# EAGLE schematic SevenSegClock (EAGLE 7.0.0)
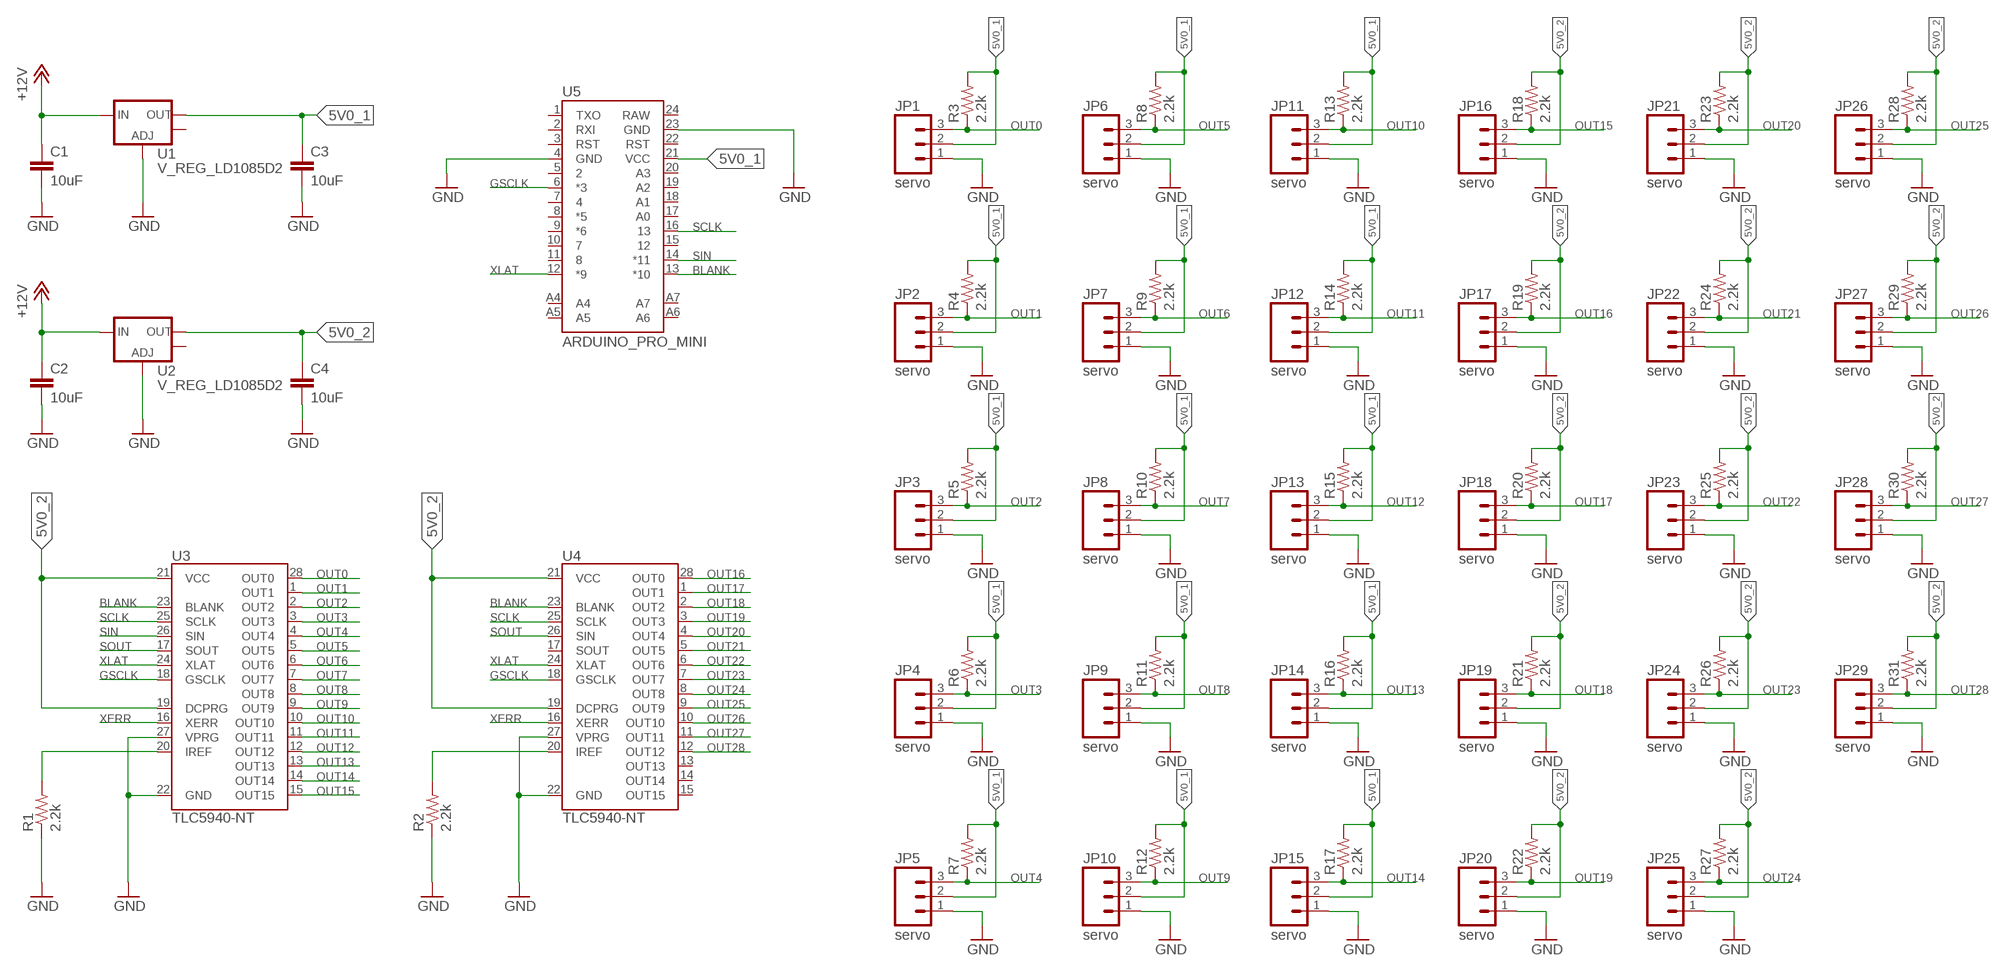
[diagram p0: schematic, sheet 1]

## Parts
C1  10uF  CAPPTH1  [CAP-PTH-5MM]
C2  10uF  CAPPTH1  [CAP-PTH-5MM]
C3  10uF  CAPPTH1  [CAP-PTH-5MM]
C4  10uF  CAPPTH1  [CAP-PTH-5MM]
JP1  servo  M03PTH  [1X03]
JP2  servo  M03PTH  [1X03]
JP3  servo  M03PTH  [1X03]
JP4  servo  M03PTH  [1X03]
JP5  servo  M03PTH  [1X03]
JP6  servo  M03PTH  [1X03]
JP7  servo  M03PTH  [1X03]
JP8  servo  M03PTH  [1X03]
JP9  servo  M03PTH  [1X03]
JP10  servo  M03PTH  [1X03]
JP11  servo  M03PTH  [1X03]
JP12  servo  M03PTH  [1X03]
JP13  servo  M03PTH  [1X03]
JP14  servo  M03PTH  [1X03]
JP15  servo  M03PTH  [1X03]
JP16  servo  M03PTH  [1X03]
JP17  servo  M03PTH  [1X03]
JP18  servo  M03PTH  [1X03]
JP19  servo  M03PTH  [1X03]
JP20  servo  M03PTH  [1X03]
JP21  servo  M03PTH  [1X03]
JP22  servo  M03PTH  [1X03]
JP23  servo  M03PTH  [1X03]
JP24  servo  M03PTH  [1X03]
JP25  servo  M03PTH  [1X03]
JP26  servo  M03PTH  [1X03]
JP27  servo  M03PTH  [1X03]
JP28  servo  M03PTH  [1X03]
JP29  servo  M03PTH  [1X03]
R1  2.2k  R-US_0204/5  [0204/5]
R2  2.2k  R-US_0204/5  [0204/5]
R3  2.2k  R-US_0204/5  [0204/5]
R4  2.2k  R-US_0204/5  [0204/5]
R5  2.2k  R-US_0204/5  [0204/5]
R6  2.2k  R-US_0204/5  [0204/5]
R7  2.2k  R-US_0204/5  [0204/5]
R8  2.2k  R-US_0204/5  [0204/5]
R9  2.2k  R-US_0204/5  [0204/5]
R10  2.2k  R-US_0204/5  [0204/5]
R11  2.2k  R-US_0204/5  [0204/5]
R12  2.2k  R-US_0204/5  [0204/5]
R13  2.2k  R-US_0204/5  [0204/5]
R14  2.2k  R-US_0204/5  [0204/5]
R15  2.2k  R-US_0204/5  [0204/5]
R16  2.2k  R-US_0204/5  [0204/5]
R17  2.2k  R-US_0204/5  [0204/5]
R18  2.2k  R-US_0204/5  [0204/5]
R19  2.2k  R-US_0204/5  [0204/5]
R20  2.2k  R-US_0204/5  [0204/5]
R21  2.2k  R-US_0204/5  [0204/5]
R22  2.2k  R-US_0204/5  [0204/5]
R23  2.2k  R-US_0204/5  [0204/5]
R24  2.2k  R-US_0204/5  [0204/5]
R25  2.2k  R-US_0204/5  [0204/5]
R26  2.2k  R-US_0204/5  [0204/5]
R27  2.2k  R-US_0204/5  [0204/5]
R28  2.2k  R-US_0204/5  [0204/5]
R29  2.2k  R-US_0204/5  [0204/5]
R30  2.2k  R-US_0204/5  [0204/5]
R31  2.2k  R-US_0204/5  [0204/5]
U1  V_REG_LD1085D2  [D2PACK/A]
U2  V_REG_LD1085D2  [D2PACK/A]
U3  TLC5940-NT  [DIL28-3]
U4  TLC5940-NT  [DIL28-3]
U5  ARDUINO_PRO_MINI  [ARDUINO_PRO_MINI]

## Nets
5V0_1: C3.1 JP1.2 JP2.2 JP3.2 JP4.2 JP5.2 JP6.2 JP7.2 JP8.2 JP9.2 JP10.2 JP11.2 JP12.2 JP13.2 JP14.2 JP15.2 R3.2 R4.2 R5.2 R6.2 R7.2 R8.2 R9.2 R10.2 R11.2 R12.2 R13.2 R14.2 R15.2 R16.2 R17.2 U1.2(OUT) U5.21(VCC)
5V0_2: C4.1 JP16.2 JP17.2 JP18.2 JP19.2 JP20.2 JP21.2 JP22.2 JP23.2 JP24.2 JP25.2 JP26.2 JP27.2 JP28.2 JP29.2 R18.2 R19.2 R20.2 R21.2 R22.2 R23.2 R24.2 R25.2 R26.2 R27.2 R28.2 R29.2 R30.2 R31.2 U2.2(OUT) U3.19(DCPRG) U3.21(VCC) U4.19(DCPRG) U4.21(VCC)
+12V: C1.1 C2.1 U1.3(IN) U2.3(IN)
BLANK: U3.23(BLANK) U4.23(BLANK) U5.13(*10)
GND: C1.2 C2.2 C3.2 C4.2 JP1.1 JP2.1 JP3.1 JP4.1 JP5.1 JP6.1 JP7.1 JP8.1 JP9.1 JP10.1 JP11.1 JP12.1 JP13.1 JP14.1 JP15.1 JP16.1 JP17.1 JP18.1 JP19.1 JP20.1 JP21.1 JP22.1 JP23.1 JP24.1 JP25.1 JP26.1 JP27.1 JP28.1 JP29.1 R1.1 R2.1 U1.1(ADJ) U2.1(ADJ) U3.22(GND) U3.27(VPRG) U4.22(GND) U4.27(VPRG) U5.4(GND) U5.23(GND)
GSCLK: U3.18(GSCLK) U4.18(GSCLK) U5.6(*3)
N$1: R1.2 U3.20(IREF)
N$2: R2.2 U4.20(IREF)
OUT0: JP1.3 R3.1 U3.28(OUT0)
OUT1: JP2.3 R4.1 U3.1(OUT1)
OUT2: JP3.3 R5.1 U3.2(OUT2)
OUT3: JP4.3 R6.1 U3.3(OUT3)
OUT4: JP5.3 R7.1 U3.4(OUT4)
OUT5: JP6.3 R8.1 U3.5(OUT5)
OUT6: JP7.3 R9.1 U3.6(OUT6)
OUT7: JP8.3 R10.1 U3.7(OUT7)
OUT8: JP9.3 R11.1 U3.8(OUT8)
OUT9: JP10.3 R12.1 U3.9(OUT9)
OUT10: JP11.3 R13.1 U3.10(OUT10)
OUT11: JP12.3 R14.1 U3.11(OUT11)
OUT12: JP13.3 R15.1 U3.12(OUT12)
OUT13: JP14.3 R16.1 U3.13(OUT13)
OUT14: JP15.3 R17.1 U3.14(OUT14)
OUT15: JP16.3 R18.1 U3.15(OUT15)
OUT16: JP17.3 R19.1 U4.28(OUT0)
OUT17: JP18.3 R20.1 U4.1(OUT1)
OUT18: JP19.3 R21.1 U4.2(OUT2)
OUT19: JP20.3 R22.1 U4.3(OUT3)
OUT20: JP21.3 R23.1 U4.4(OUT4)
OUT21: JP22.3 R24.1 U4.5(OUT5)
OUT22: JP23.3 R25.1 U4.6(OUT6)
OUT23: JP24.3 R26.1 U4.7(OUT7)
OUT24: JP25.3 R27.1 U4.8(OUT8)
OUT25: JP26.3 R28.1 U4.9(OUT9)
OUT26: JP27.3 R29.1 U4.10(OUT10)
OUT27: JP28.3 R30.1 U4.11(OUT11)
OUT28: JP29.3 R31.1 U4.12(OUT12)
SCLK: U3.25(SCLK) U4.25(SCLK) U5.16
SIN: U3.26(SIN) U5.14(*11)
SOUT: U3.17(SOUT) U4.26(SIN)
XERR: U3.16(XERR) U4.16(XERR)
XLAT: U3.24(XLAT) U4.24(XLAT) U5.12(*9)
Unconnected: U1.TAB(OUT) U2.TAB(OUT) U4.13(OUT13) U4.14(OUT14) U4.15(OUT15) U4.17(SOUT) U5.1(TXO) U5.2(RXI) U5.3(RST) U5.5 U5.7 U5.8(*5) U5.9(*6) U5.10 U5.11 U5.15 U5.17(A0) U5.18(A1) U5.19(A2) U5.20(A3) U5.22(RST) U5.24(RAW) U5.A4 U5.A5 U5.A6 U5.A7

## Library data of the parts
C1-C4 = SparkFun-Capacitors:CAP: Capacitor Standard 0603 ceramic capacitor, and 0.1" leaded capacitor.
JP1-JP29 = SparkFun-Connectors:M03: Header 3 Standard 3-pin 0.1" header. Use with straight break away headers (SKU : PRT-00116), right angle break away headers (PRT-00553), swiss pins (PRT-00743), machine pins (PRT-00117), and female headers (PRT-00115). Molex polarized connector foot print use with SKU : PRT-08232 with associated crimp pins and housings.
R1-R31 = resistor:R-US_: RESISTOR, American symbol
U1 U2 = SparkFun-PowerIC:V_REG_LD1085: LD1085 3A low-drop positive voltage regulator, adjustable The LD1085xx is a low drop voltage regulator able to provide up to 3 A of output current. Dropout is guaranteed at a maximum of 1.2 V at the maximum output current, decreasing at lower loads. The LD1085xx is pin to pin compatible with the older 3-terminal adjustable regulators, but has better performances in term of drop and output tolerance. Available Packages D2PAK/A - 3-pin w/ tabs, SMD
U3 U4 = SparkFun-DigitalIC:TLC5940: 16-channel LED Driver with Dot Correction and Grayscale PWM Control The TLC5940 is a 16-channel, constant-current sink LED driver. Each channel has an individually adjustable 4096-step grayscale PWM brightness control and a 64-step, constant-current sink (dot correction). The dot correction adjusts the brightness variations between LED channels and other LED drivers. The dot correction data is stored in an integrated EEPROM. Both grayscale control and dot correction are accessible via a serial interface. A single external resistor sets the maximum current value of all 16 channels. Packages: 28-pin HTSSOP 32-pin 5x5mm QFN 28-pin DIP
U5 = SparkFun-Boards:ARDUINO_PRO_MINI